# Altium project Mixed Signal Board Project.PrjPcb
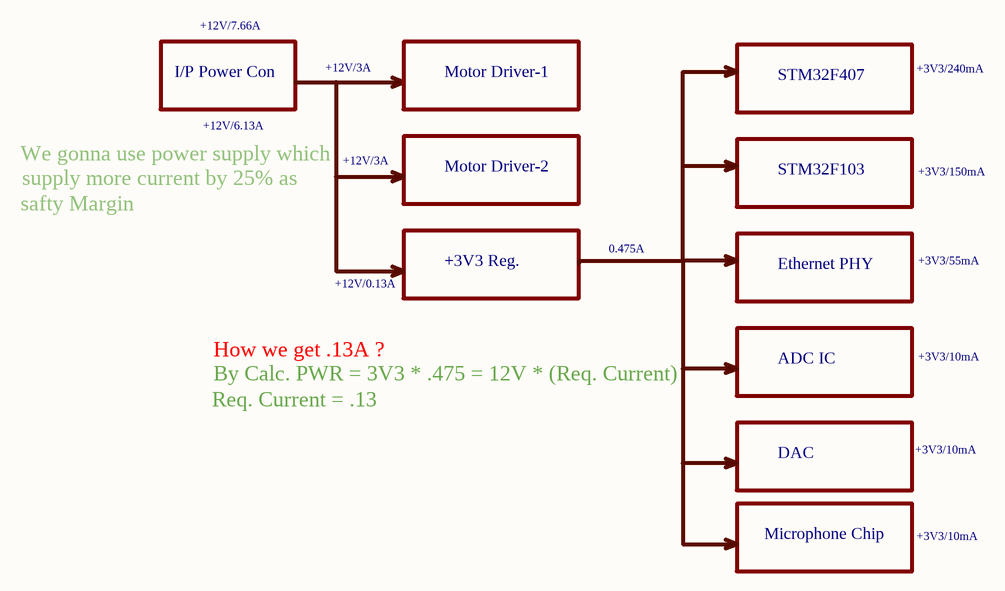
[diagram p0: [2] Power Budget.SchDoc]
7 sheets, 116 parts. Net scope: flat (ports and power ports of the same name join across sheets).
Board file: Mixed Signal Board Project.PcbDoc
Sheets:
  [2] Power Budget.SchDoc
  [4] Ethernet PHY.SchDoc
  [5] Motor Driver Schematic.SchDoc
  [6] CH340C.SchDoc
  [7] ADC Chip.SchDoc
  [10] Motor Driver-2.SchDoc
  [11] Power Input and Regualtor.SchDoc

## Sheet [2] Power Budget.SchDoc
size A3; DocumentNumber: 2; SheetNumber: 2; SheetTotal: 11

### Notes on the sheet
- +12V/7.66A
- I/P Power Con
- +12V/6.13A
- +12V/3A
- Motor Driver-1
- STM32F407
- +3V3/240mA
- We gonna use power supply which
- supply more current by 25% as
- Motor Driver-2
- STM32F103
- +3V3/150mA
- safty Margin
- +3V3 Reg.
- 0.475A
- Ethernet PHY
- +3V3/55mA
- +12V/0.13A
- Req. Current = .13
- How we get .13A ?
- By Calc. PWR = 3V3 * .475 = 12V * (Req. Current)
- ADC IC
- +3V3/10mA
- DAC
- Microphone Chip

## Sheet [4] Ethernet PHY.SchDoc
size A; DocumentNumber: 4; SheetNumber: 4; SheetTotal: 11
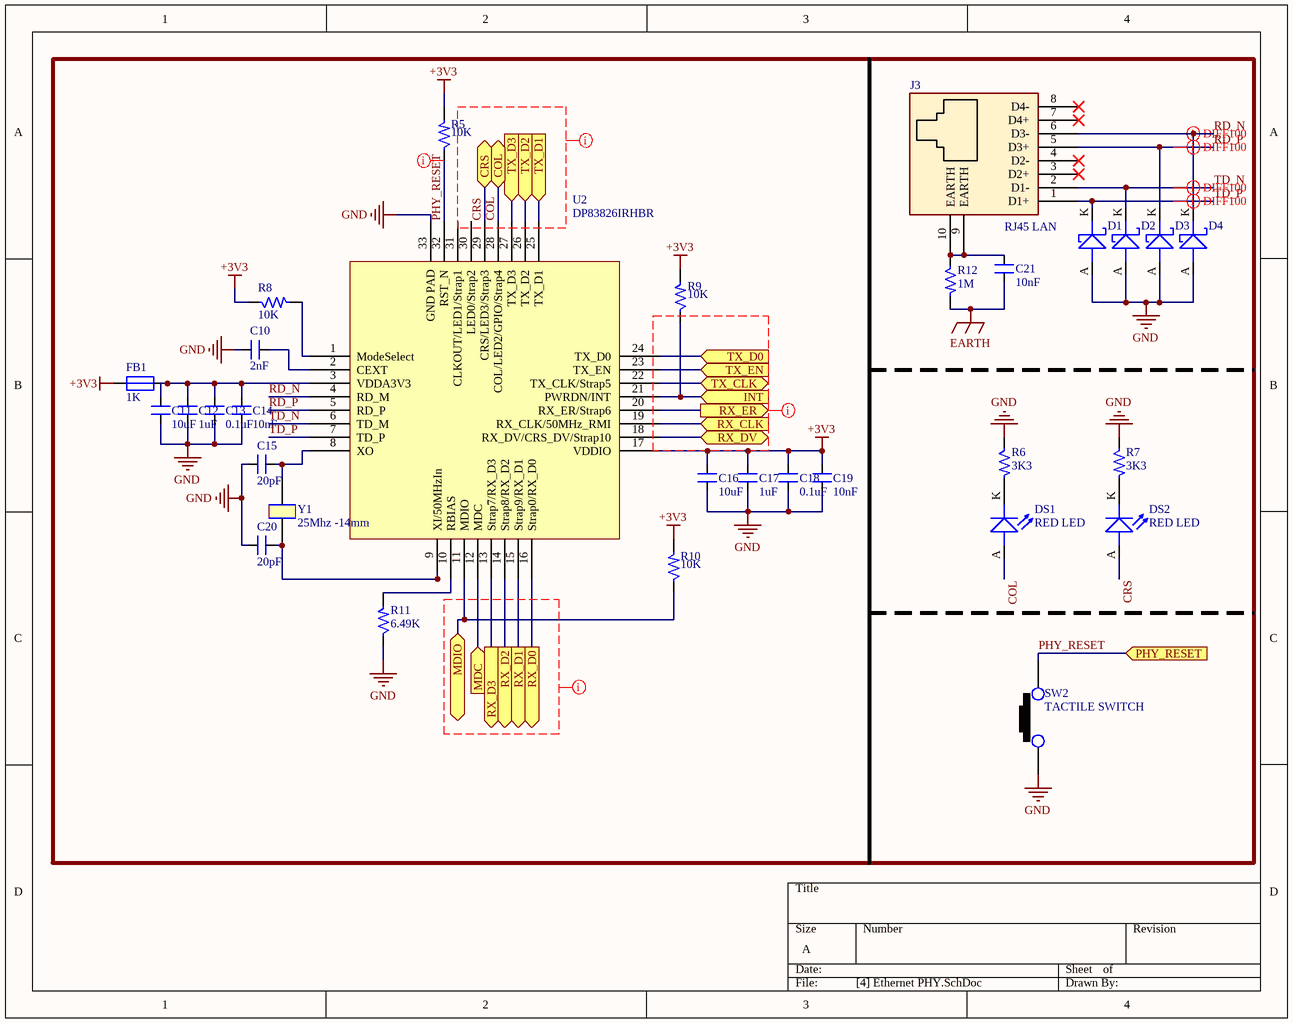
[diagram p1: [4] Ethernet PHY.SchDoc]

### Parts
C10  2nF  [CAP_0805]
C11  10uF  [CAP_1206]
C12  1uF  [CAP_0805]
C13  0.1uF  [CAP_0805]
C14  10nF  [CAP_0805]
C15  20pF  [CAP_0805]
C16  10uF  [CAP_1206]
C17  1uF  [CAP_0805]
C18  0.1uF  [CAP_0805]
C19  10nF  [CAP_0805]
C20  20pF  [CAP_0805]
C21  10nF  [CAP_P196_102X287_H332_RAD_TH]
D1  ESD3V3D9-TP  [DIO_SOD-923]  (value not drawn)
D2  ESD3V3D9-TP  [DIO_SOD-923]  (value not drawn)
D3  ESD3V3D9-TP  [DIO_SOD-923]  (value not drawn)
D4  ESD3V3D9-TP  [DIO_SOD-923]  (value not drawn)
DS1  RED LED  [LED_0805]
DS2  RED LED  [LED_0805]
FB1  1K  [IND_0805]
J3  RJ45 LAN  [CON10_P106_RJ45_TH_ST]
R5  10K  [RES_0603]
R6  3K3  [RES_0603]
R7  3K3  [RES_0603]
R8  10K  [RES_0603]
R9  10K  [RES_0603]
R10  10K  [RES_0603]
R11  6.49K  [RES_0805]
R12  1M  [RES_1206]
SW2  TACTILE SWITCH  [SW_342_SMD]
U2  DP83826IRHBR  [VQFN32_19_218_23X9_SMD]
Y1  25Mhz -14mm  [XTAL_314_240X47_SMD]

### Ports
COL (bidir), CRS (bidir), INT (in), MDC (in), MDIO (bidir), PHY_RESET (in), RX_CLK (in), RX_D0 (out), RX_D1 (out), RX_D2 (out), RX_D3 (out), RX_DV (bidir), RX_ER (out), TX_CLK (bidir), TX_D0 (in), TX_D1 (in), TX_D2 (in), TX_D3 (in), TX_EN (in)

### Nets
+3V3: C16.2 C17.2 C18.2 C19.2 FB1.1 R5.2 R8.1 R9.2 R10.2 U2.17(VDDIO)
EARTH: C21.1 R12.2
GND: C10.1 C11.1 C12.1 C13.1 C14.1 C15.1 C16.1 C17.1 C18.1 C19.1 C20.1 D1.A D2.A D3.A D4.A R6.1 R7.1 R11.1 SW2.1 U2.33(GND_PAD)
COL: DS1.A(ANODE) U2.28(COL/LED2/GPIO/Strap4) ; port COL
CRS: DS2.A(ANODE) U2.29(CRS/LED3/Strap3) ; port CRS
INT: R9.1 U2.21(PWRDN/INT) ; port INT
MDC: U2.12(MDC) ; port MDC
MDIO: R10.1 U2.11(MDIO) ; port MDIO
PHY_RESET: R5.1 SW2.2 U2.32(RST_N) ; port PHY_RESET
RD_N: D4.K J3.6(D3-) U2.4(RD_M)
RD_P: D3.K J3.5(D3+) U2.5(RD_P)
RX_CLK: U2.19(RX_CLK/50MHz_RMI) ; port RX_CLK
RX_D0: U2.16(Strap0/RX_D0) ; port RX_D0
RX_D1: U2.15(Strap9/RX_D1) ; port RX_D1
RX_D2: U2.14(Strap8/RX_D2) ; port RX_D2
RX_D3: U2.13(Strap7/RX_D3) ; port RX_D3
RX_DV: U2.18(RX_DV/CRS_DV/Strap10) ; port RX_DV
RX_ER: U2.20(RX_ER/Strap6) ; port RX_ER
TD_N: D2.K J3.2(D1-) U2.6(TD_M)
TD_P: D1.K J3.1(D1+) U2.7(TD_P)
TX_CLK: U2.22(TX_CLK/Strap5) ; port TX_CLK
TX_D0: U2.24(TX_D0) ; port TX_D0
TX_D1: U2.25(TX_D1) ; port TX_D1
TX_D2: U2.26(TX_D2) ; port TX_D2
TX_D3: U2.27(TX_D3) ; port TX_D3
TX_EN: U2.23(TX_EN) ; port TX_EN
NetC10_2: C10.2 U2.2(CEXT)
NetC11_2: C11.2 C12.2 C13.2 C14.2 FB1.2 U2.3(VDDA3V3)
NetC15_2: C15.2 U2.8(XO) Y1.2
NetC20_2: C20.2 U2.9(XI/50MHzIn) Y1.1
NetC21_2: C21.2 J3.9(EARTH) J3.10(EARTH) R12.1
NetDS1_K: DS1.K(CATHODE) R6.2
NetDS2_K: DS2.K(CATHODE) R7.2
NetR8_2: R8.2 U2.1(ModeSelect)
NetR11_2: R11.2 U2.10(RBIAS)

Not connected (* = marked no-connect by the designer): J3 3(D2+)* 4(D2-)* 7(D4+)* 8(D4-)*; U2 30(LED0/Strap2) 31(CLKOUT/LED1/Strap1)

### Layout directives
differential pair; differential pair class DIFF100: RD_N, RD_P, TD_N, TD_P
net class 50OHM: (no net found under the mark), COL, CRS, RX_ER
net class Critical Nets: PHY_RESET

### Library data of the parts
C10 = CAP_2nF-50V-10%-0805: 2000pF ±10% 50V Ceramic Capacitor X7R 0805 (2012 Metric); Manufacturer: Samsung Electro-Mechanics; Manufacturer Part Number: CL21B202KBANNNC; Alternate Part Number-1: NA; Case/Package: 0805; Supplier-1: Digikey; Supplier Part Number-1: 1276-2471-1-ND - Cut Tape (CT)
C11 C16 = CAP_10uF-50V-10%-1206: 10µF ±10% 50V Ceramic Capacitor X7R 1206 (3216 Metric); Manufacturer: KEMET; Manufacturer Part Number: CL31B106KBHNNNE; Alternate Part Number-1: GRT31CR61H106ME01L; Case/Package: 1206; Supplier-1: SIRICOM; Supplier Part Number-1: CC1206KKX5R9BB106
C12 C17 = CAP_1uF-50V-5%-0805: 1µF ±5% 50V Ceramic Capacitor X7R 0805 (2012 Metric); Manufacturer: Samsung; Manufacturer Part Number: CC0805JKX7R9BB105; Alternate Part Number-1: 0805F105M500NT; Case/Package: 0805; Supplier-1: SIRICOM; Supplier Part Number-1: CL21B105KBFNNNE
C13 C18 = CAP_0.1uF-50V-10%-0805: 0.1µF ±10% 50V Ceramic Capacitor X7R 0805 (2012 Metric); Manufacturer: Samsung; Manufacturer Part Number: CL21B104KBCNNNC; Alternate Part Number-1: NA; Case/Package: 0805; Supplier-1: SIRICOM; Supplier Part Number-1: 0805B104K500CT
C14 C19 = CAP_10nF-50V-10%-0805: 10000pF ±10% 50V Ceramic Capacitor X7R 0805 (2012 Metric); Manufacturer: Samsung; Manufacturer Part Number: C0805C103K5RECAUTO; Alternate Part Number-1: GRM2195C1H103JA01D; Case/Package: 0805; Supplier-1: SIRICOM; Supplier Part Number-1: 0805B103K500CT
C15 C20 = CAP_20pF-50V-10%-0805: ±10% 50V Ceramic Capacitor C0G, NP0 0805 (2012 Metric); Manufacturer: AVX Corporation; Manufacturer Part Number: 08055A200KAT2A; Alternate Part Number-1: NA; Case/Package: 0805; Supplier-1: Digikey; Supplier Part Number-1: 478-11887-1-ND - Cut Tape (CT)
C21 = CAP_10nF-1KV-10%-RAD-TH: 10000pF ±10% 1000V (1kV) Ceramic Capacitor X7R Radial; Manufacturer: Yageo; Manufacturer Part Number: RDER73A103K2K1H03B; Alternate Part Number-1: NA; Case/Package: TH; Supplier-1: SP ROAD; Supplier Part Number-1: RDER73A103K2K1H03B
D1-D4 = DIO-T_3.3V-8.8V-SOD923: 8.8V Clamp 5A (8/20µs) Ipp Tvs Diode Surface Mount SOD-923; Manufacturer: Micro Commercial Co; Alternate Part Number-1: NA; Manufacturer Part Number: ESD3V3D9-TP; Case/Package: SOD923; Supplier-1: Digikey; Supplier Part Number-1: ESD3V3D9-TPMSCT-ND - Cut Tape (CT)
DS1 DS2 = LED_RED-2V-20mA-0805: Red 631nm LED Indication - Discrete 2V 0805 (2012 Metric); Manufacturer: Vishay Lite-On; Manufacturer Part Number: LTST-C171KRKT; Alternate Part Number-1: NA; Case/Package: 0805; Supplier-1: SP ROAD; Supplier Part Number-1: LTST-C171KRKT
FB1 = FB_1K-100MHZ-1.6A-0805: 1 kOhms @ 100MHz 1 Power Line Ferrite Bead 0805 (2012 Metric) 1.6A; Manufacturer: Laird; Manufacturer Part Number: BLM21SP102SH1D; Alternate Part Number-1: NA; Case/Package: 0805; Supplier-1: SIRICOM; Supplier Part Number-1: ACMS201209A102
J3 = CON-SKT-RJ_8C8P-RA-TH: 8 Pins, 2 Row 2.54mm Pitch, right angle Connector, male; Manufacturer: Assmann; Manufacturer Part Number: A-2004-2-4-LPS-N-R; Alternate Part Number-1: NA; Case/Package: TH-CON; Supplier-1: SP ROAD; Supplier Part Number-1: A-2004-2-4-LPS-N-R
R5 R8-R10 = RES_10K-0.1W-1%-0603: 10 kOhms ±1% 0.1W, 1/10W Chip Resistor 0603 (1608 Metric) Automotive AEC-Q200 Thick Film; Manufacturer: Walsin; Manufacturer Part Number: WR06X1002FTL; Alternate Part Number-1: 0603WAJ0103T5E; Case/Package: 0603; Supplier-1: SIRICOM; Supplier Part Number-1: WR06X1002FTL
R6 R7 = RES_3.3K-0.1W-1%-0603: 3.3 kOhms ±1% 0.1W, 1/10W Chip Resistor 0603 (1608 Metric) Automotive AEC-Q200 Thick Film; Manufacturer: Wilson; Manufacturer Part Number: WR06X3301FTL; Alternate Part Number-1: 0603WAF3301T5E; Case/Package: 0603; Supplier-1: SIRICOM; Supplier Part Number-1: WR06X3301FTL
R11 = RES_6.49K-0.125W-1%-0805: 6.49 kOhms ±1% 0.125W, 1/8W Chip Resistor 0805 (2012 Metric) Moisture Resistant Thick Film; Manufacturer: Stackpole Electronics; Manufacturer Part Number: RC0805FR-076K49L; Alternate Part Number-1: NA; Case/Package: 0805; Supplier-1: SIRICOM; Supplier Part Number-1: WRO8X6491FTL
R12 = RES_1M-0.25W-1%-1206: 1 MOhms ±1% 0.25W, 1/4W Chip Resistor 1206 (3216 Metric) Automotive AEC-Q200, High Voltage Thick Film; Manufacturer: Walsin; Manufacturer Part Number: WR12X1004FTL; Alternate Part Number-1: NA; Case/Package: 1206; Supplier-1: SIRICOM; Supplier Part Number-1: WR12X1004FTL
SW2 = SW1_RS-282G05A3-SMRT-SMD: Tactile Switch SPST-NO Top Actuated Surface Mount; Manufacturer: ITT C&K; Alternate Part Number-1: NA; Manufacturer Part Number: RS-282G05A3-SMRT; Case/Package: SMD; Supplier-1: SP ROAD; Supplier Part Number-1: RS-282G05A3-SMRT
U2 = IC_DP83826IRHBR: Ethernet ICs Low latency 10/100-Mbps PHY, MII interface and enhanced mode with an industrial temperature range 32-VQFN -40 to 85; Manufacturer: Texas Instruments; Alternate Part Number-1: NA; Manufacturer Part Number: DP83826IRHBR; Case/Package: 32-VQFN; Supplier-1: Mouser; Supplier Part Number-1: 595-DP83826IRHBR
Y1 = XTAL_25Mhz-FOXSDLF/250F-20: 25MHz ±30ppm Crystal 20pF 30 Ohms HC-49/US; Manufacturer: Abracon; Alternate Part Number-1: NA; Manufacturer Part Number: FOXSDLF/250F-20; Case/Package: SMD; Supplier-1: MOUSER; Supplier Part Number-1: FOXSDLF/250F-20

## Sheet [5] Motor Driver Schematic.SchDoc
size A; DocumentNumber: 5; SheetNumber: 5; SheetTotal: 11
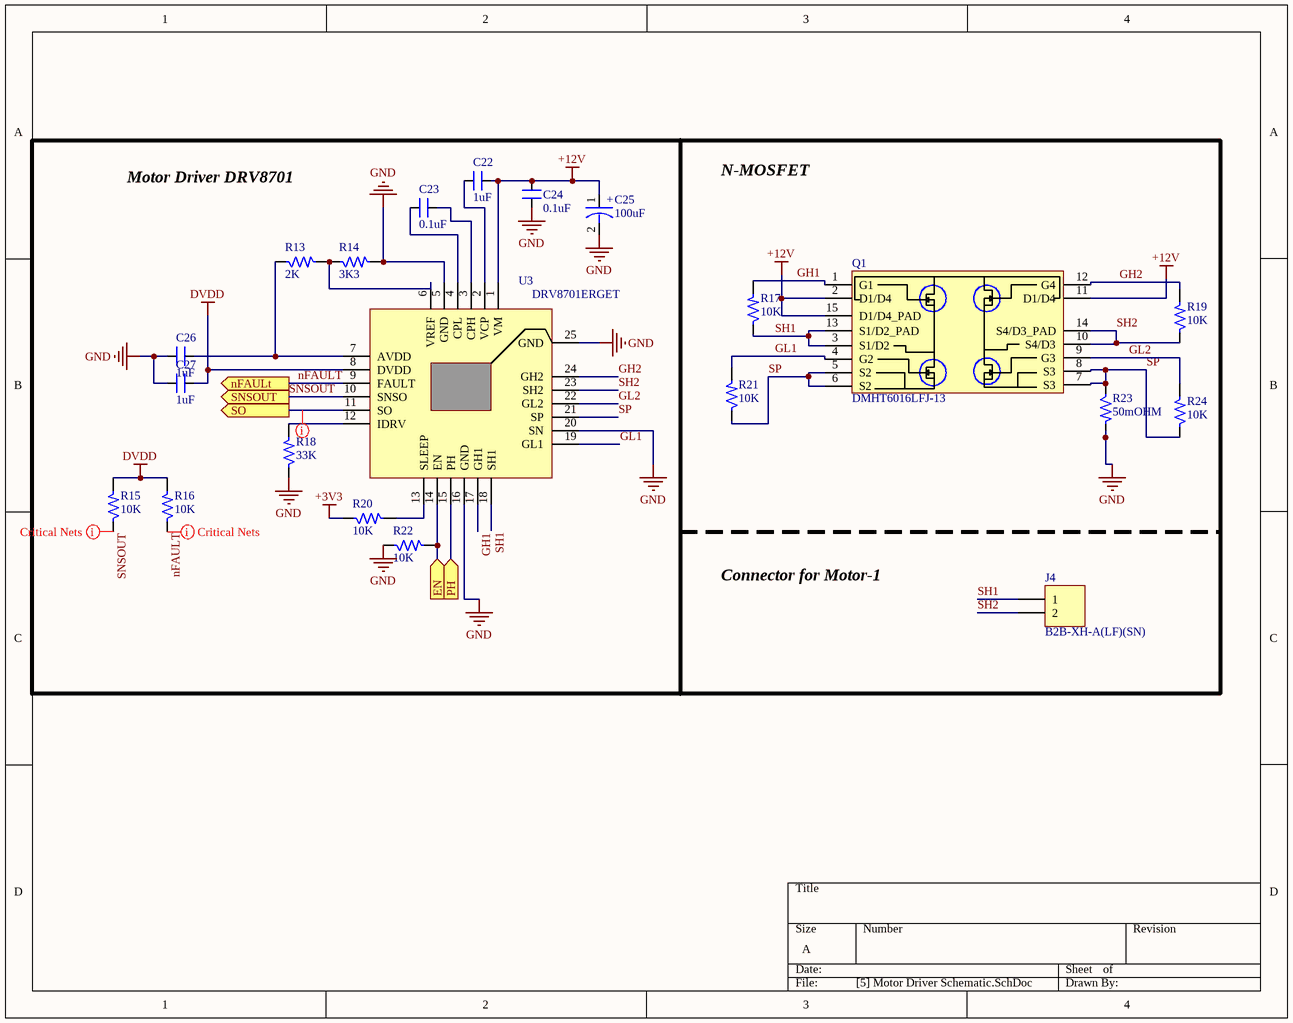
[diagram p2: [5] Motor Driver Schematic.SchDoc]

### Parts
C22  1uF  [CAP_0805]
C23  0.1uF  [CAP_0805]
C24  0.1uF  [CAP_0805]
C25  100uF  [ACAP_P236_D305_H303_RAD]
C26  1uF  [CAP_0805]
C27  1uF  [CAP_0805]
J4  B2B-XH-A(LF)(SN)  [CON2_100_B2B-XH-A_TH_ST]
Q1  DMHT6016LFJ-13  [DFN5045-12_33_212_27X15_SMD_1]
R13  2K  [RES_0603]
R14  3K3  [RES_0603]
R15  10K  [RES_0603]
R16  10K  [RES_0603]
R17  10K  [RES_0603]
R18  33K  [RES_0805]
R19  10K  [RES_0603]
R20  10K  [RES_0603]
R21  10K  [RES_0603]
R22  10K  [RES_0603]
R23  50mOHM  [RES_2512]
R24  10K  [RES_0603]
U3  DRV8701ERGET  [VFQFN24_19.6_196_12X32_SMD_1]

### Ports
EN (in), nFAULt (out), PH (in), SNSOUT (out), SO (out)

### Nets
+3V3: R20.1
+12V: C22.1 C24.2 C25.1 Q1.2(D1/D4) Q1.11(D1/D4) Q1.15(D1/D4_PAD) U3.1(VM)
DVDD: C27.2 R15.2 R16.2 U3.8(DVDD)
GND: C24.1 C25.2 C26.1 C27.1 R14.2 R18.1 R22.1 R23.2 U3.5(GND) U3.16(GND) U3.20(SN) U3.25(GND)
EN: R22.2 U3.14(EN) ; port EN
GH1: Q1.1(G1) R17.2 U3.17(GH1)
GH2: Q1.12(G4) R19.2 U3.24(GH2)
GL1: Q1.4(G2) R21.2 U3.19(GL1)
GL2: Q1.9(G3) R24.2 U3.22(GL2)
nFAULT: R16.1 U3.9(FAULT) ; port nFAULt
PH: U3.15(PH) ; port PH
SH1: J4.1 Q1.3(S1/D2) Q1.13(S1/D2_PAD) R17.1 U3.18(SH1)
SH2: J4.2 Q1.10(S4/D3) Q1.14(S4/D3_PAD) R19.1 U3.23(SH2)
SNSOUT: R15.1 U3.10(SNSO) ; port SNSOUT
SO: U3.11(SO) ; port SO
SP: Q1.5(S2) Q1.6(S2) Q1.7(S3) Q1.8(S3) R21.1 R23.1 R24.1 U3.21(SP)
NetC22_2: C22.2 U3.2(VCP)
NetC23_1: C23.1 U3.3(CPH)
NetC23_2: C23.2 U3.4(CPL)
NetC26_2: C26.2 R13.1 U3.7(AVDD)
NetR13_2: R13.2 R14.1 U3.6(VREF)
NetR18_2: R18.2 U3.12(IDRV)
NetR20_2: R20.2 U3.13(SLEEP)

### Layout directives
net class Critical Nets: nFAULT, SNSOUT, SO

### Notes on the sheet
- Motor Driver DRV8701
- N-MOSFET
- Connector for Motor-1
- (in symbol CAP-P_100uF-25V-20%-RAD) +

### Library data of the parts
C22 C26 C27 = CAP_1uF-50V-5%-0805: as C12 on sheet [4] Ethernet PHY; Case/Package: 0805; Supplier-1: SIRICOM; Supplier Part Number-1: CL21B105KBFNNNE
C23 C24 = CAP_0.1uF-50V-10%-0805: as C13 on sheet [4] Ethernet PHY; Case/Package: 0805; Supplier-1: SIRICOM; Supplier Part Number-1: 0805B104K500CT
C25 = CAP-P_100uF-25V-20%-RAD: 100µF 25V Aluminum Electrolytic Capacitors Radial, Can - SMD 1000 Hrs @ 105°C; Manufacturer: Nichicon; Manufacturer Part Number: UWT1E101MCL1GS; Alternate Part Number-1: NA; Case/Package: Radial-SMD; Supplier-1: SP ROAD; Supplier Part Number-1: UWT1E101MCL1GS
J4 = CON-PLG_2X1-100-ST-TH: 2 Pins, 1 Row 2.54mm Pitch, Straight Connector, male; Manufacturer: JST; Mating Part Number: XHP-2; Crimp Part Number: ASXHSXH22K51; Alternate Part Number-1: NA; Manufacturer Part Number: B2B-XH-A(LF)(SN); Case/Package: TH-CON; Supplier-1: SP ROAD; Supplier Part Number-1: B2B-XH-A(LF)(SN)
Q1 = MOSFET-N_60V-14.8A-V-DFN5045-12: Mosfet Array 4 N-Channel 14.8A (Ta) Surface Mount V-DFN5045-12; Manufacturer: ON Semiconductor; Alternate Part Number-1: DMHT3006LFJ-13; Manufacturer Part Number: DMHT6016LFJ-13; Case/Package: DFN5045-12; Supplier-1: LCSC; Supplier Part Number-1: C460986
R13 = RES_2K-0.125W-1%-0603: 2 kOhms ±1% 0.125W, 1/8W Chip Resistor 0603 (1608 Metric) Anti-Sulfur, Moisture Resistant Thin Film; Manufacturer: Stackpole Electronics; Manufacturer Part Number: RNCP0603FTD2K00; Alternate Part Number-1: NA; Case/Package: 0603; Supplier-1: SIRICOM; Supplier Part Number-1: WR06X2001FTL
R14 = RES_3.3K-0.1W-1%-0603: as R6 on sheet [4] Ethernet PHY; Case/Package: 0603; Supplier-1: SIRICOM; Supplier Part Number-1: WR06X3301FTL
R15-R17 R19-R22 R24 = RES_10K-0.1W-1%-0603: as R5 on sheet [4] Ethernet PHY; Case/Package: 0603; Supplier-1: SIRICOM; Supplier Part Number-1: WR06X1002FTL
R18 = RES_33K-0.125W-1%-0805: Thick Film Resistors - SMD 33KOhms 1/8W 150V33 kOhms ±1% 0.125W, 1/8W Chip Resistor 0805 (2012 Metric) Thick Film; Manufacturer: Vishay BCcomponents; Manufacturer Part Number: CRG0805F33K; Alternate Part Number-1: NA; Case/Package: 0805; Supplier-1: SIRICOM; Supplier Part Number-1: WR08X3302FTL
R23 = RES_50mOhm-2W-1%-2512: 50 mOhms ±1% 2W Chip Resistor 2512 (6432 Metric) Automotive AEC-Q200, Current Sense, Moisture Resistant Metal Element; Manufacturer: Yageo; Manufacturer Part Number: PA2512FKF7W0R05E; Alternate Part Number-1: PMR100HZPFU5L00; Case/Package: 2512; Supplier-1: SIRICOM; Supplier Part Number-1: LR2512-22R060F1
U3 = IC_DRV8701ERGET: Motor Driver Power MOSFET Parallel 24-VQFN (4x4); Manufacturer: Texas Instruments; Alternate Part Number-1: NA; Manufacturer Part Number: DRV8701ERGET; Case/Package: VFQFN24; Supplier-1: ARROW; Supplier Part Number-1: DRV8701ERGET

## Sheet [6] CH340C.SchDoc
size A; DocumentNumber: 6; SheetNumber: 6; SheetTotal: 11
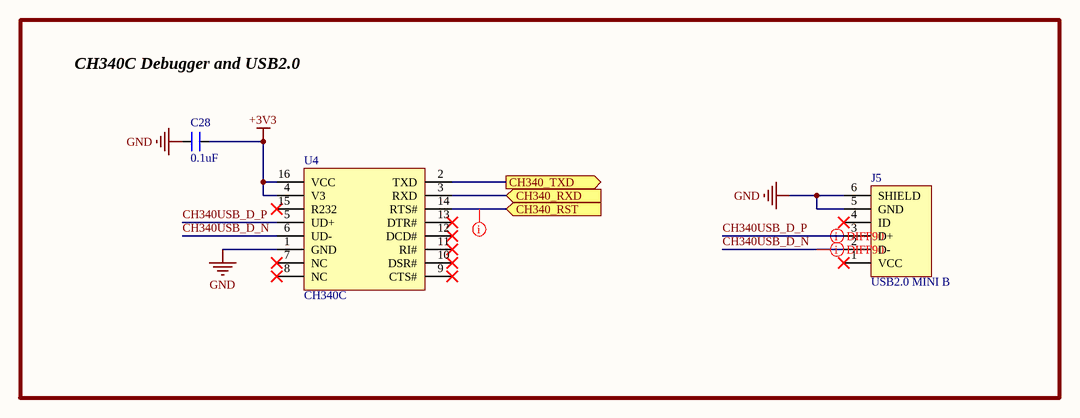
[diagram p3: [6] CH340C.SchDoc]

### Parts
C28  0.1uF  [CAP_0805]
J5  USB2.0 MINI B  [CON_690-005-299-043]
U4  CH340C  [SOIC16_50_284_25X90_SMT]

### Blocks framed on the sheet
CH340C Debugger and USB2.0: C28 J5 U4

### Ports
CH340_RST (in), CH340_RXD (in), CH340_TXD (out)

### Nets
+3V3: C28.2 U4.4(V3) U4.16(VCC)
GND: C28.1 J5.5(GND) J5.6(SHIELD) U4.1(GND)
CH340_RST: U4.14(RTS#) ; port CH340_RST
CH340_RXD: U4.3(RXD) ; port CH340_RXD
CH340_TXD: U4.2(TXD) ; port CH340_TXD
CH340USB_D_N: J5.2(D-) U4.6(UD-)
CH340USB_D_P: J5.3(D+) U4.5(UD+)

Not connected (* = marked no-connect by the designer): J5 1(VCC)* 4(ID)*; U4 7(NC)* 8(NC)* 9(CTS#)* 10(DSR#)* 11(RI#)* 12(DCD#)* 13(DTR#)* 15(R232)*

### Layout directives
differential pair; differential pair class DIFF90: CH340USB_D_N, CH340USB_D_P
net class Critical Nets: CH340_RST

### Library data of the parts
C28 = CAP_0.1uF-50V-10%-0805: as C13 on sheet [4] Ethernet PHY; Case/Package: 0805; Supplier-1: SIRICOM; Supplier Part Number-1: 0805B104K500CT
J5 = CON_USB2.0-MINIB-SMD: USB - mini B USB 2.0 Receptacle Connector 5 Position Surface Mount, Right Angle; Manufacturer: EDAC; Manufacturer Part Number: 690-005-299-043; Alternate Part Number-1: NA; Case/Package: USB-MINI-B; Supplier-1: LCSC; Supplier Part Number-1: C105424
U4 = IC_CH340C: USB Bridge, USB to UART USB 2.0 UART Interface; Manufacturer: Olimex; Alternate Part Number-1: NA; Manufacturer Part Number: CH340C; Case/Package: SOIC16; Supplier-1: LCSC; Supplier Part Number-1: C84681

## Sheet [7] ADC Chip.SchDoc
size A; DocumentNumber: 7; SheetNumber: 7; SheetTotal: 11
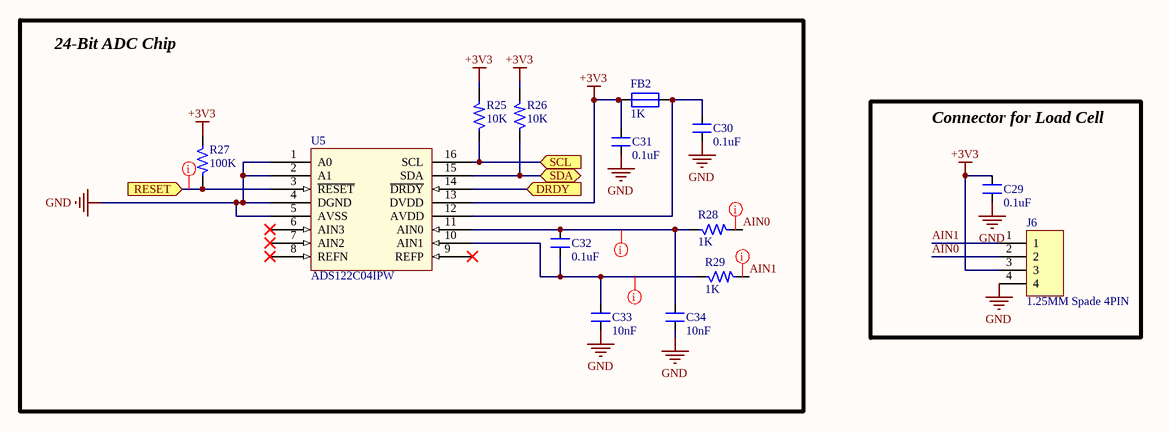
[diagram p4: [7] ADC Chip.SchDoc]

### Parts
C29  0.1uF  [CAP_0805]
C30  0.1uF  [CAP_0805]
C31  0.1uF  [CAP_0805]
C32  0.1uF  [CAP_0805]
C33  10nF  [CAP_0805]
C34  10nF  [CAP_0805]
FB2  1K  [IND_0805]
J6  1.25MM Spade 4PIN  [CON4_50_653004117322_TH_RA]
R25  10K  [RES_0603]
R26  10K  [RES_0603]
R27  100K  [RES_0603]
R28  1K  [RES_0603]
R29  1K  [RES_0603]
U5  ADS122C04IPW  [TSSOP16_25-59_294_54X14_SMT]

### Blocks framed on the sheet
24-Bit ADC Chip: C30-C34 FB2 R25-R29 U5
Connector for Load Cell: C29 J6

### Ports
DRDY (in), RESET (in), SCL (in), SDA (bidir)

### Nets
+3V3: C29.2 C31.2 FB2.1 J6.3 R25.2 R26.2 R27.1 U5.13(DVDD)
GND: C29.1 C30.1 C31.1 C33.2 C34.2 J6.4 U5.1(A0) U5.2(A1) U5.4(DGND) U5.5(AVSS)
AIN0: J6.2 R28.2
AIN1: J6.1 R29.2
DRDY: U5.14(~{DRDY}) ; port DRDY
RESET: R27.2 U5.3(~{RESET}) ; port RESET
SCL: R25.1 U5.16(SCL) ; port SCL
SDA: R26.1 U5.15(SDA) ; port SDA
NetC30_2: C30.2 FB2.2 U5.12(AVDD)
NetC32_1: C32.1 C33.1 R29.1 U5.10(AIN1)
NetC32_2: C32.2 C34.1 R28.1 U5.11(AIN0)

Not connected (* = marked no-connect by the designer): U5 6(AIN3)* 7(AIN2)* 8(REFN)* 9(REFP)*

### Layout directives
net class Critical Nets: (no net found under the mark), NetC32_1, NetC32_2, RESET

### Library data of the parts
C29-C32 = CAP_0.1uF-50V-10%-0805: as C13 on sheet [4] Ethernet PHY; Case/Package: 0805; Supplier-1: SIRICOM; Supplier Part Number-1: 0805B104K500CT
C33 C34 = CAP_10nF-50V-10%-0805: as C14 on sheet [4] Ethernet PHY; Case/Package: 0805; Supplier-1: SIRICOM; Supplier Part Number-1: 0805B103K500CT
FB2 = FB_1K-100MHZ-1.6A-0805: as FB1 on sheet [4] Ethernet PHY; Case/Package: 0805; Supplier-1: SIRICOM; Supplier Part Number-1: ACMS201209A102
J6 = CON-PLG_4X1-50-RA-TH: 4 Pins, 1 Row 1.25mm Pitch, right angle Connector, male; Manufacturer Part Number: 653004117322; Manufacturer: JST; Mating Part Number: 653004113322; Crimp Part Number: 653153128130; Alternate Part Number-1: NA; Case/Package: TH-CON; Supplier-1: WURTH; Supplier Part Number-1: 653004117322
R25 R26 = RES_10K-0.1W-1%-0603: as R5 on sheet [4] Ethernet PHY; Case/Package: 0603; Supplier-1: SIRICOM; Supplier Part Number-1: WR06X1002FTL
R27 = RES_100K-0.1W-1%-0603: 100 kOhms ±1% 0.1W, 1/10W Chip Resistor 0603 (1608 Metric) Automotive AEC-Q200 Thick Film; Manufacturer: Stackpole Electronics; Manufacturer Part Number: RMCF0603FT100K; Alternate Part Number-1: NA; Case/Package: 0603; Supplier-1: Arrow; Supplier Part Number-1: RMCF0603FT100K
R28 R29 = RES_1K-0.1W-1%-0603: 1 kOhms ±1% 0.1W, 1/10W Chip Resistor 0603 (1608 Metric) Automotive AEC-Q200 Thick Film; Manufacturer: Walsin; Manufacturer Part Number: WR06X1001FTL; Alternate Part Number-1: 0603WAF1001T5E; Case/Package: 0603; Supplier-1: SIRICOM; Supplier Part Number-1: WR06X1001FTL
U5 = IC_ADS122C04IPW: 24 Bit Analog to Digital Converter 4 Input 1 Sigma-Delta 16-TSSOP; Manufacturer: Texas Instruments; Alternate Part Number-1: NA; Manufacturer Part Number: ADS122C04IPW; Case/Package: TSSOP16; Supplier-1: MOUSER; Supplier Part Number-1: ADS122C04IPW

## Sheet [10] Motor Driver-2.SchDoc
size A; DocumentNumber: 10; SheetNumber: 10; SheetTotal: 11
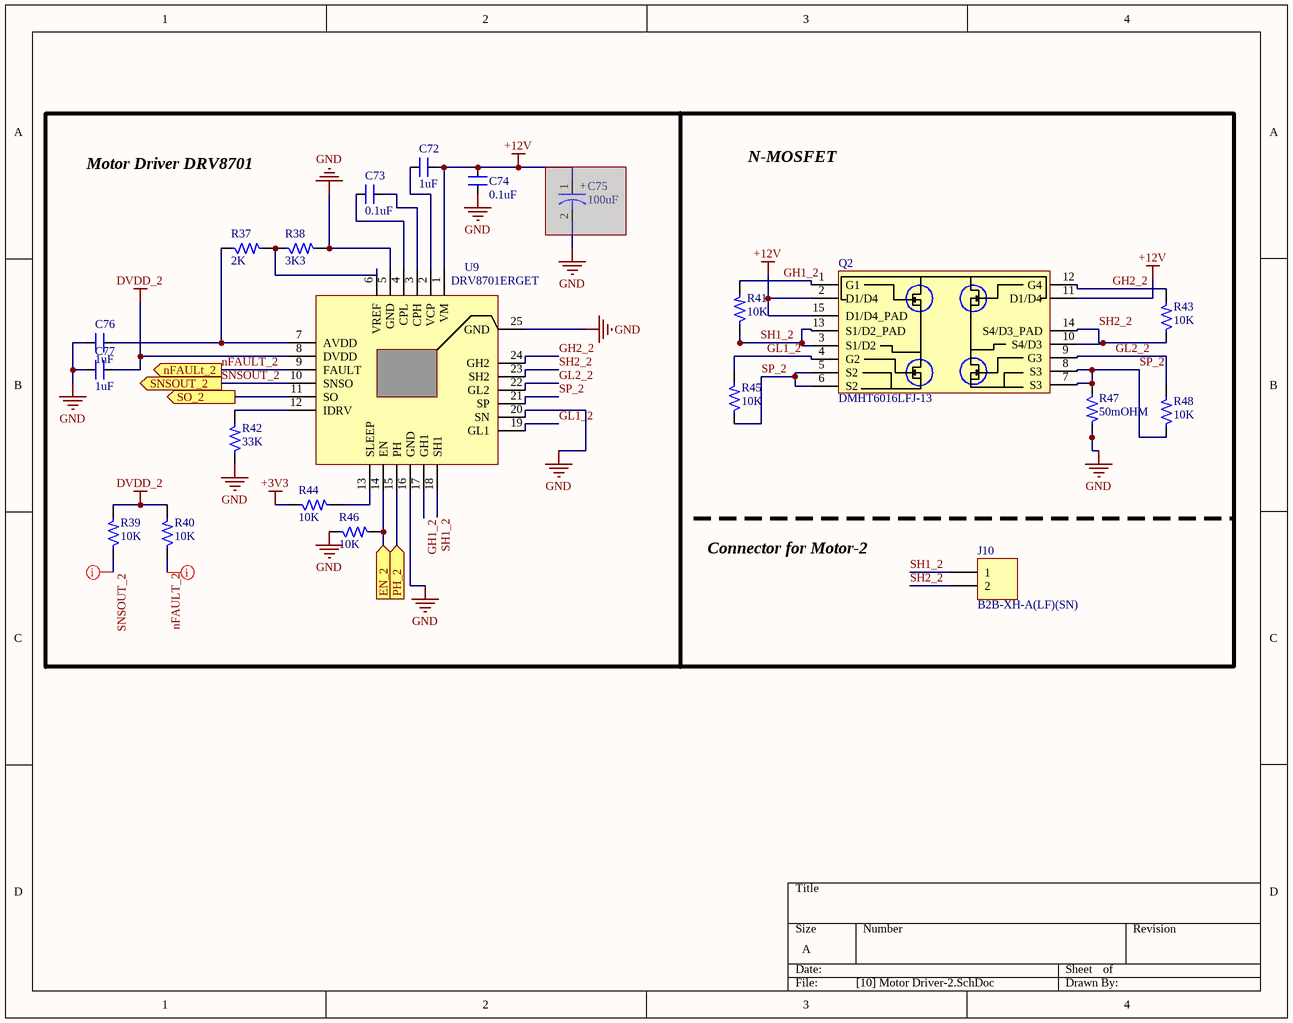
[diagram p5: [10] Motor Driver-2.SchDoc]

### Parts
C72  1uF  [CAP_0805]
C73  0.1uF  [CAP_0805]
C74  0.1uF  [CAP_0805]
C75  100uF  [ACAP_P236_D305_H303_RAD]  (masked out: inside a compile mask, not in the netlist)
C76  1uF  [CAP_0805]
C77  1uF  [CAP_0805]
J10  B2B-XH-A(LF)(SN)  [CON2_100_B2B-XH-A_TH_ST]
Q2  DMHT6016LFJ-13  [DFN5045-12_33_212_27X15_SMD_1]
R37  2K  [RES_0603]
R38  3K3  [RES_0603]
R39  10K  [RES_0603]
R40  10K  [RES_0603]
R41  10K  [RES_0603]
R42  33K  [RES_0805]
R43  10K  [RES_0603]
R44  10K  [RES_0603]
R45  10K  [RES_0603]
R46  10K  [RES_0603]
R47  50mOHM  [RES_2512]
R48  10K  [RES_0603]
U9  DRV8701ERGET  [VFQFN24_19.6_196_12X32_SMD_1]

### Ports
EN_2 (in), nFAULt_2 (out), PH_2 (in), SNSOUT_2 (out), SO_2 (out)

### Nets
+3V3: R44.1
+12V: C72.1 C74.2 Q2.2(D1/D4) Q2.11(D1/D4) Q2.15(D1/D4_PAD) U9.1(VM)
DVDD_2: C77.2 R39.2 R40.2 U9.8(DVDD)
GND: C74.1 C76.1 C77.1 R38.2 R42.1 R46.1 R47.2 U9.5(GND) U9.16(GND) U9.20(SN) U9.25(GND)
EN_2: R46.2 U9.14(EN) ; port EN_2
GH1_2: Q2.1(G1) R41.2 U9.17(GH1)
GH2_2: Q2.12(G4) R43.2 U9.24(GH2)
GL1_2: Q2.4(G2) R45.2 U9.19(GL1)
GL2_2: Q2.9(G3) R48.2 U9.22(GL2)
nFAULT_2: R40.1 U9.9(FAULT) ; port nFAULt_2
PH_2: U9.15(PH) ; port PH_2
SH1_2: J10.1 Q2.3(S1/D2) Q2.13(S1/D2_PAD) R41.1 U9.18(SH1)
SH2_2: J10.2 Q2.10(S4/D3) Q2.14(S4/D3_PAD) R43.1 U9.23(SH2)
SNSOUT_2: R39.1 U9.10(SNSO) ; port SNSOUT_2
SO_2: U9.11(SO) ; port SO_2
SP_2: Q2.5(S2) Q2.6(S2) Q2.7(S3) Q2.8(S3) R45.1 R47.1 R48.1 U9.21(SP)
NetC72_2: C72.2 U9.2(VCP)
NetC73_1: C73.1 U9.3(CPH)
NetC73_2: C73.2 U9.4(CPL)
NetC76_2: C76.2 R37.1 U9.7(AVDD)
NetR37_2: R37.2 R38.1 U9.6(VREF)
NetR42_2: R42.2 U9.12(IDRV)
NetR44_2: R44.2 U9.13(SLEEP)

### Layout directives
net class Critical Nets: nFAULT_2, SNSOUT_2

### Notes on the sheet
- N-MOSFET
- Motor Driver DRV8701
- Connector for Motor-2
- (in symbol CAP-P_100uF-25V-20%-RAD) +

### Library data of the parts
C72 C76 C77 = CAP_1uF-50V-5%-0805: as C12 on sheet [4] Ethernet PHY; Case/Package: 0805; Supplier-1: SIRICOM; Supplier Part Number-1: CL21B105KBFNNNE
C73 C74 = CAP_0.1uF-50V-10%-0805: as C13 on sheet [4] Ethernet PHY; Case/Package: 0805; Supplier-1: SIRICOM; Supplier Part Number-1: 0805B104K500CT
C75 = CAP-P_100uF-25V-20%-RAD: as C25 on sheet [5] Motor Driver Schematic; Case/Package: Radial-SMD; Supplier-1: SP ROAD; Supplier Part Number-1: UWT1E101MCL1GS
J10 = CON-PLG_2X1-100-ST-TH: as J4 on sheet [5] Motor Driver Schematic; Manufacturer Part Number: B2B-XH-A(LF)(SN); Case/Package: TH-CON; Supplier-1: SP ROAD; Supplier Part Number-1: B2B-XH-A(LF)(SN)
Q2 = MOSFET-N_60V-14.8A-V-DFN5045-12: as Q1 on sheet [5] Motor Driver Schematic; Manufacturer Part Number: DMHT6016LFJ-13; Case/Package: DFN5045-12; Supplier-1: LCSC; Supplier Part Number-1: C460986
R37 = RES_2K-0.125W-1%-0603: as R13 on sheet [5] Motor Driver Schematic; Case/Package: 0603; Supplier-1: SIRICOM; Supplier Part Number-1: WR06X2001FTL
R38 = RES_3.3K-0.1W-1%-0603: as R6 on sheet [4] Ethernet PHY; Case/Package: 0603; Supplier-1: SIRICOM; Supplier Part Number-1: WR06X3301FTL
R39-R41 R43-R46 R48 = RES_10K-0.1W-1%-0603: as R5 on sheet [4] Ethernet PHY; Case/Package: 0603; Supplier-1: SIRICOM; Supplier Part Number-1: WR06X1002FTL
R42 = RES_33K-0.125W-1%-0805: as R18 on sheet [5] Motor Driver Schematic; Case/Package: 0805; Supplier-1: SIRICOM; Supplier Part Number-1: WR08X3302FTL
R47 = RES_50mOhm-2W-1%-2512: as R23 on sheet [5] Motor Driver Schematic; Case/Package: 2512; Supplier-1: SIRICOM; Supplier Part Number-1: LR2512-22R060F1
U9 = IC_DRV8701ERGET: as U3 on sheet [5] Motor Driver Schematic; Manufacturer Part Number: DRV8701ERGET; Case/Package: VFQFN24; Supplier-1: ARROW; Supplier Part Number-1: DRV8701ERGET

## Sheet [11] Power Input and Regualtor.SchDoc
size A; DocumentNumber: 11; SheetNumber: 11; SheetTotal: 11
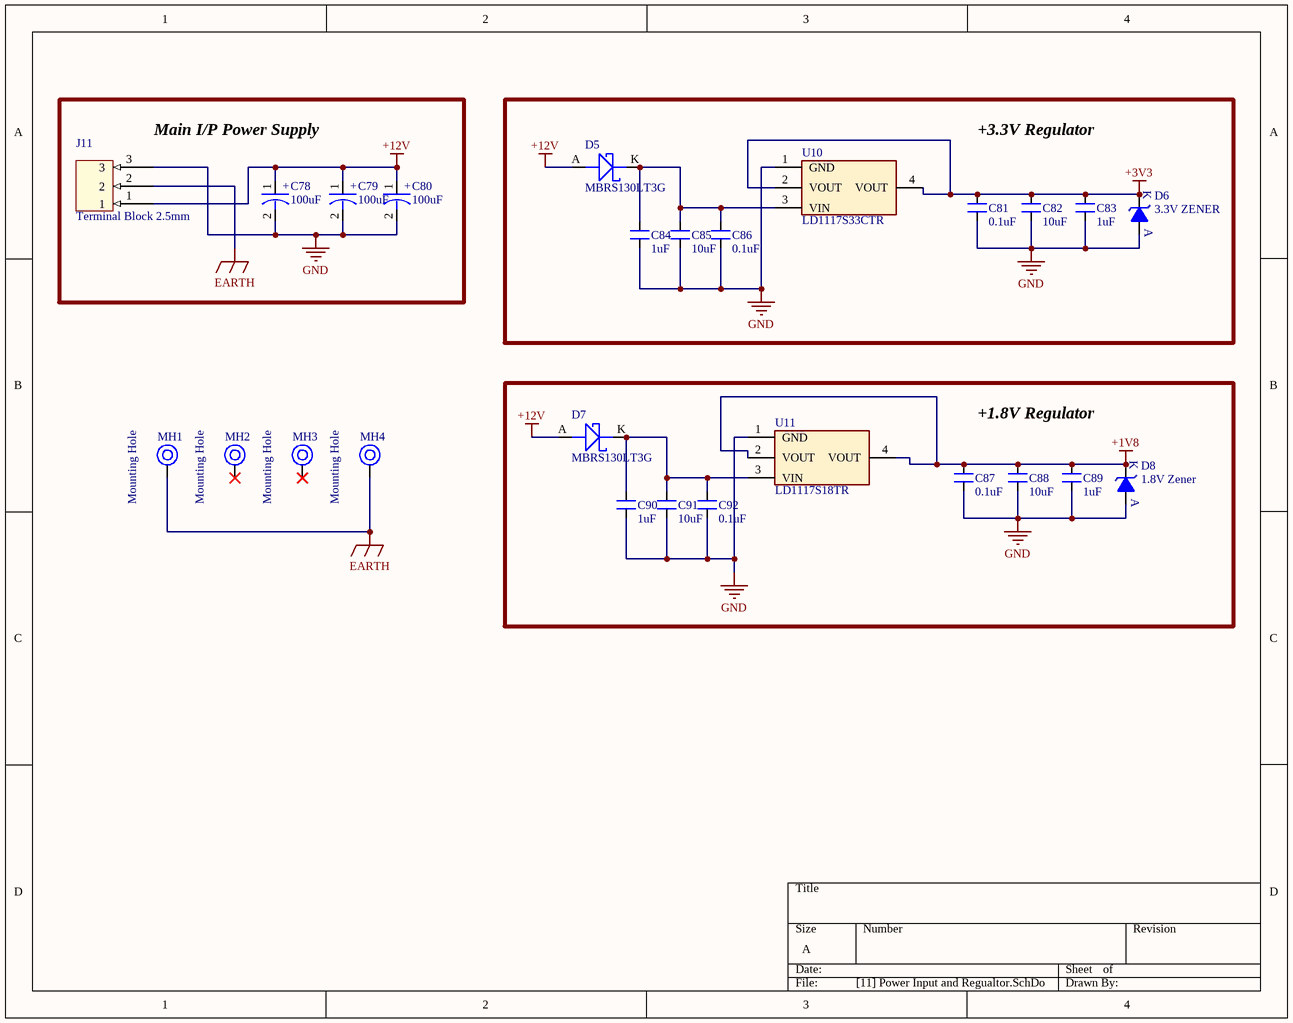
[diagram p6: [11] Power Input and Regualtor.SchDoc]

### Parts
C78  100uF  [ACAP_P305_D393_H393_RAD]
C79  100uF  [ACAP_P305_D393_H393_RAD]
C80  100uF  [ACAP_P305_D393_H393_RAD]
C81  0.1uF  [CAP_0805]
C82  10uF  [CAP_1206]
C83  1uF  [CAP_0805]
C84  1uF  [CAP_0805]
C85  10uF  [CAP_1206]
C86  0.1uF  [CAP_0805]
C87  0.1uF  [CAP_0805]
C88  10uF  [CAP_1206]
C89  1uF  [CAP_0805]
C90  1uF  [CAP_0805]
C91  10uF  [CAP_1206]
C92  0.1uF  [CAP_0805]
D5  MBRS130LT3G  [DIO_SMB_DO-214AA]
D6  3.3V ZENER  [DIO_SOD80C]
D7  MBRS130LT3G  [DIO_SMB_DO-214AA]
D8  1.8V Zener  [DIO_DO-213AB_SMD]
J11  Terminal Block 2.5mm  [CON3_100_TB_TH_ST]
MH1  Mounting Hole  [MOUNTING]
MH2  Mounting Hole  [MOUNTING]
MH3  Mounting Hole  [MOUNTING]
MH4  Mounting Hole  [MOUNTING]
U10  LD1117S33CTR  [SOT223_3]
U11  LD1117S18TR  [SOT223_3]

### Blocks framed on the sheet
Main I/P Power Supply: C78-C80 J11
+3.3V Regulator: C81-C86 D5 D6 U10
+1.8V Regulator: C87-C92 D7 D8 U11

### Nets
+1V8: C87.2 C88.1 C89.2 D8.K U11.2(VOUT) U11.4(VOUT)
+3V3: C81.2 C82.1 C83.2 D6.K U10.2(VOUT) U10.4(VOUT)
+12V: C78.1 C79.1 C80.1 D5.A D7.A J11.1
EARTH: J11.2 MH1.1 MH4.1
GND: C78.2 C79.2 C80.2 C81.1 C82.2 C83.1 C84.1 C85.2 C86.1 C87.1 C88.2 C89.1 C90.1 C91.2 C92.1 D6.A D8.A J11.3 U10.1(GND) U11.1(GND)
NetC84_2: C84.2 C85.1 C86.2 D5.K U10.3(VIN)
NetC90_2: C90.2 C91.1 C92.2 D7.K U11.3(VIN)

Not connected (* = marked no-connect by the designer): MH2 1*; MH3 1*

### Notes on the sheet
- (in symbol CAP-P_100uF-50V-20%-RAD) +

### Library data of the parts
C78-C80 = CAP-P_100uF-50V-20%-RAD: 100µF 50V Aluminum Polymer Capacitor Radial, Can - SMD 28mOhm 4000 Hrs @ 125°C; Manufacturer: Nichicon; Manufacturer Part Number: GYA1H101MCQ1GS; Alternate Part Number-1: VEU101M1HTR-1010; Case/Package: Radial-SMD; Supplier-1: SP ROAD; Supplier Part Number-1: GYA1H101MCQ1GS
C81 C86 C87 C92 = CAP_0.1uF-50V-10%-0805: as C13 on sheet [4] Ethernet PHY; Case/Package: 0805; Supplier-1: SIRICOM; Supplier Part Number-1: 0805B104K500CT
C82 C85 C88 C91 = CAP_10uF-50V-10%-1206: as C11 on sheet [4] Ethernet PHY; Case/Package: 1206; Supplier-1: SIRICOM; Supplier Part Number-1: CC1206KKX5R9BB106
C83 C84 C89 C90 = CAP_1uF-50V-5%-0805: as C12 on sheet [4] Ethernet PHY; Case/Package: 0805; Supplier-1: SIRICOM; Supplier Part Number-1: CL21B105KBFNNNE
D5 D7 = DIO-S_445mV-30V-2A-SMB: Diode Schottky 30V 2A Surface Mount SMB; Manufacturer: ON Semiconductor; Alternate Part Number-1: NA; Manufacturer Part Number: MBRS130LT3G; Case/Package: SMB; Supplier-1: ARROW; Supplier Part Number-1: MBRS130LT3G
D6 = DIO-Z_3.3V-500mW-SOD-80: Zener Diode 3.3V 500mW ±5% Surface Mount LLDS; MiniMelf; Manufacturer: Vishay Semiconductors; Manufacturer Part Number: BZV55-C3V3,135; Alternate Part Number-1: TZM5226B-GS08; Case/Package: SOD-80; Supplier-1: SIRICOM; Supplier Part Number-1: BZV55-C3V3
D8 = DIO-Z_1.8V-500mW-DO213AA: Zener Diode 1.8V 500mW ±5% Surface Mount DO-213AA; Manufacturer: *; Manufacturer Part Number: *; Case/Package: *; Supplier-1: *; Supplier Part Number-1: *; Alternate Part Number-1: *
J11 = CON-TB_3X1-100-ST-TH: 3 Pins, 1 Row 2.54mm Pitch, straight Connector, male; Manufacturer Part Number: 1725669; Manufacturer: Phoenix Contact; Alternate Part Number-1: NA; Case/Package: TH-CON; Supplier-1: SP ROAD; Supplier Part Number-1: 1725669
MH1-MH4 = MH_3.5H_6D: Manufacturer Part Number: NA; Case/Package: TH; Manufacturer: NA; Supplier-1: NA; Supplier Part Number-1: NA; Alternate Part Number-1: NA
U10 = REG_15V-3.3V-0.9A-12W-SOT223: Linear Voltage Regulator IC 1 Output 800mA SOT-223; Manufacturer: STMicroelectronics; Alternate Part Number-1: NA; Manufacturer Part Number: LD1117S33CTR; Case/Package: SOT223; Supplier-1: SP ROAD; Supplier Part Number-1: LD1117S33CTR
U11 = REG_15V-1.8V-0.8A-1.4W-SOT223: LDO Voltage Regulators 1.8V 0.8A Positive; Manufacturer: STMicroelectronics; Alternate Part Number-1: NA; Manufacturer Part Number: LD1117S18TR; Case/Package: SOT-223-3; Supplier-1: Mouser; Supplier Part Number-1: 511-LD1117S18-TR

## Nets that join several sheets
+3V3: [4] Ethernet PHY (10 pins), [5] Motor Driver Schematic (R20.1), [6] CH340C (C28.2 U4.4 U4.16), [7] ADC Chip (8 pins), [10] Motor Driver-2 (R44.1), [11] Power Input and Regualtor (6 pins)
+12V: [5] Motor Driver Schematic (7 pins), [10] Motor Driver-2 (6 pins), [11] Power Input and Regualtor (6 pins)
EARTH: [4] Ethernet PHY (C21.1 R12.2), [11] Power Input and Regualtor (J11.2 MH1.1 MH4.1)
GND: [4] Ethernet PHY (20 pins), [5] Motor Driver Schematic (12 pins), [6] CH340C (C28.1 J5.5 J5.6 U4.1), [7] ADC Chip (10 pins), [10] Motor Driver-2 (11 pins), [11] Power Input and Regualtor (20 pins)